# Altium schematic sheet pca10095_sheet3_interface_mcu.SchDoc: PCA10095 - Interface MCU
size A3; Organization: Nordic Semiconductor; DocumentNumber: 3; SheetNumber: 3; SheetTotal: 6; CompanyName: Nordic Semiconductor
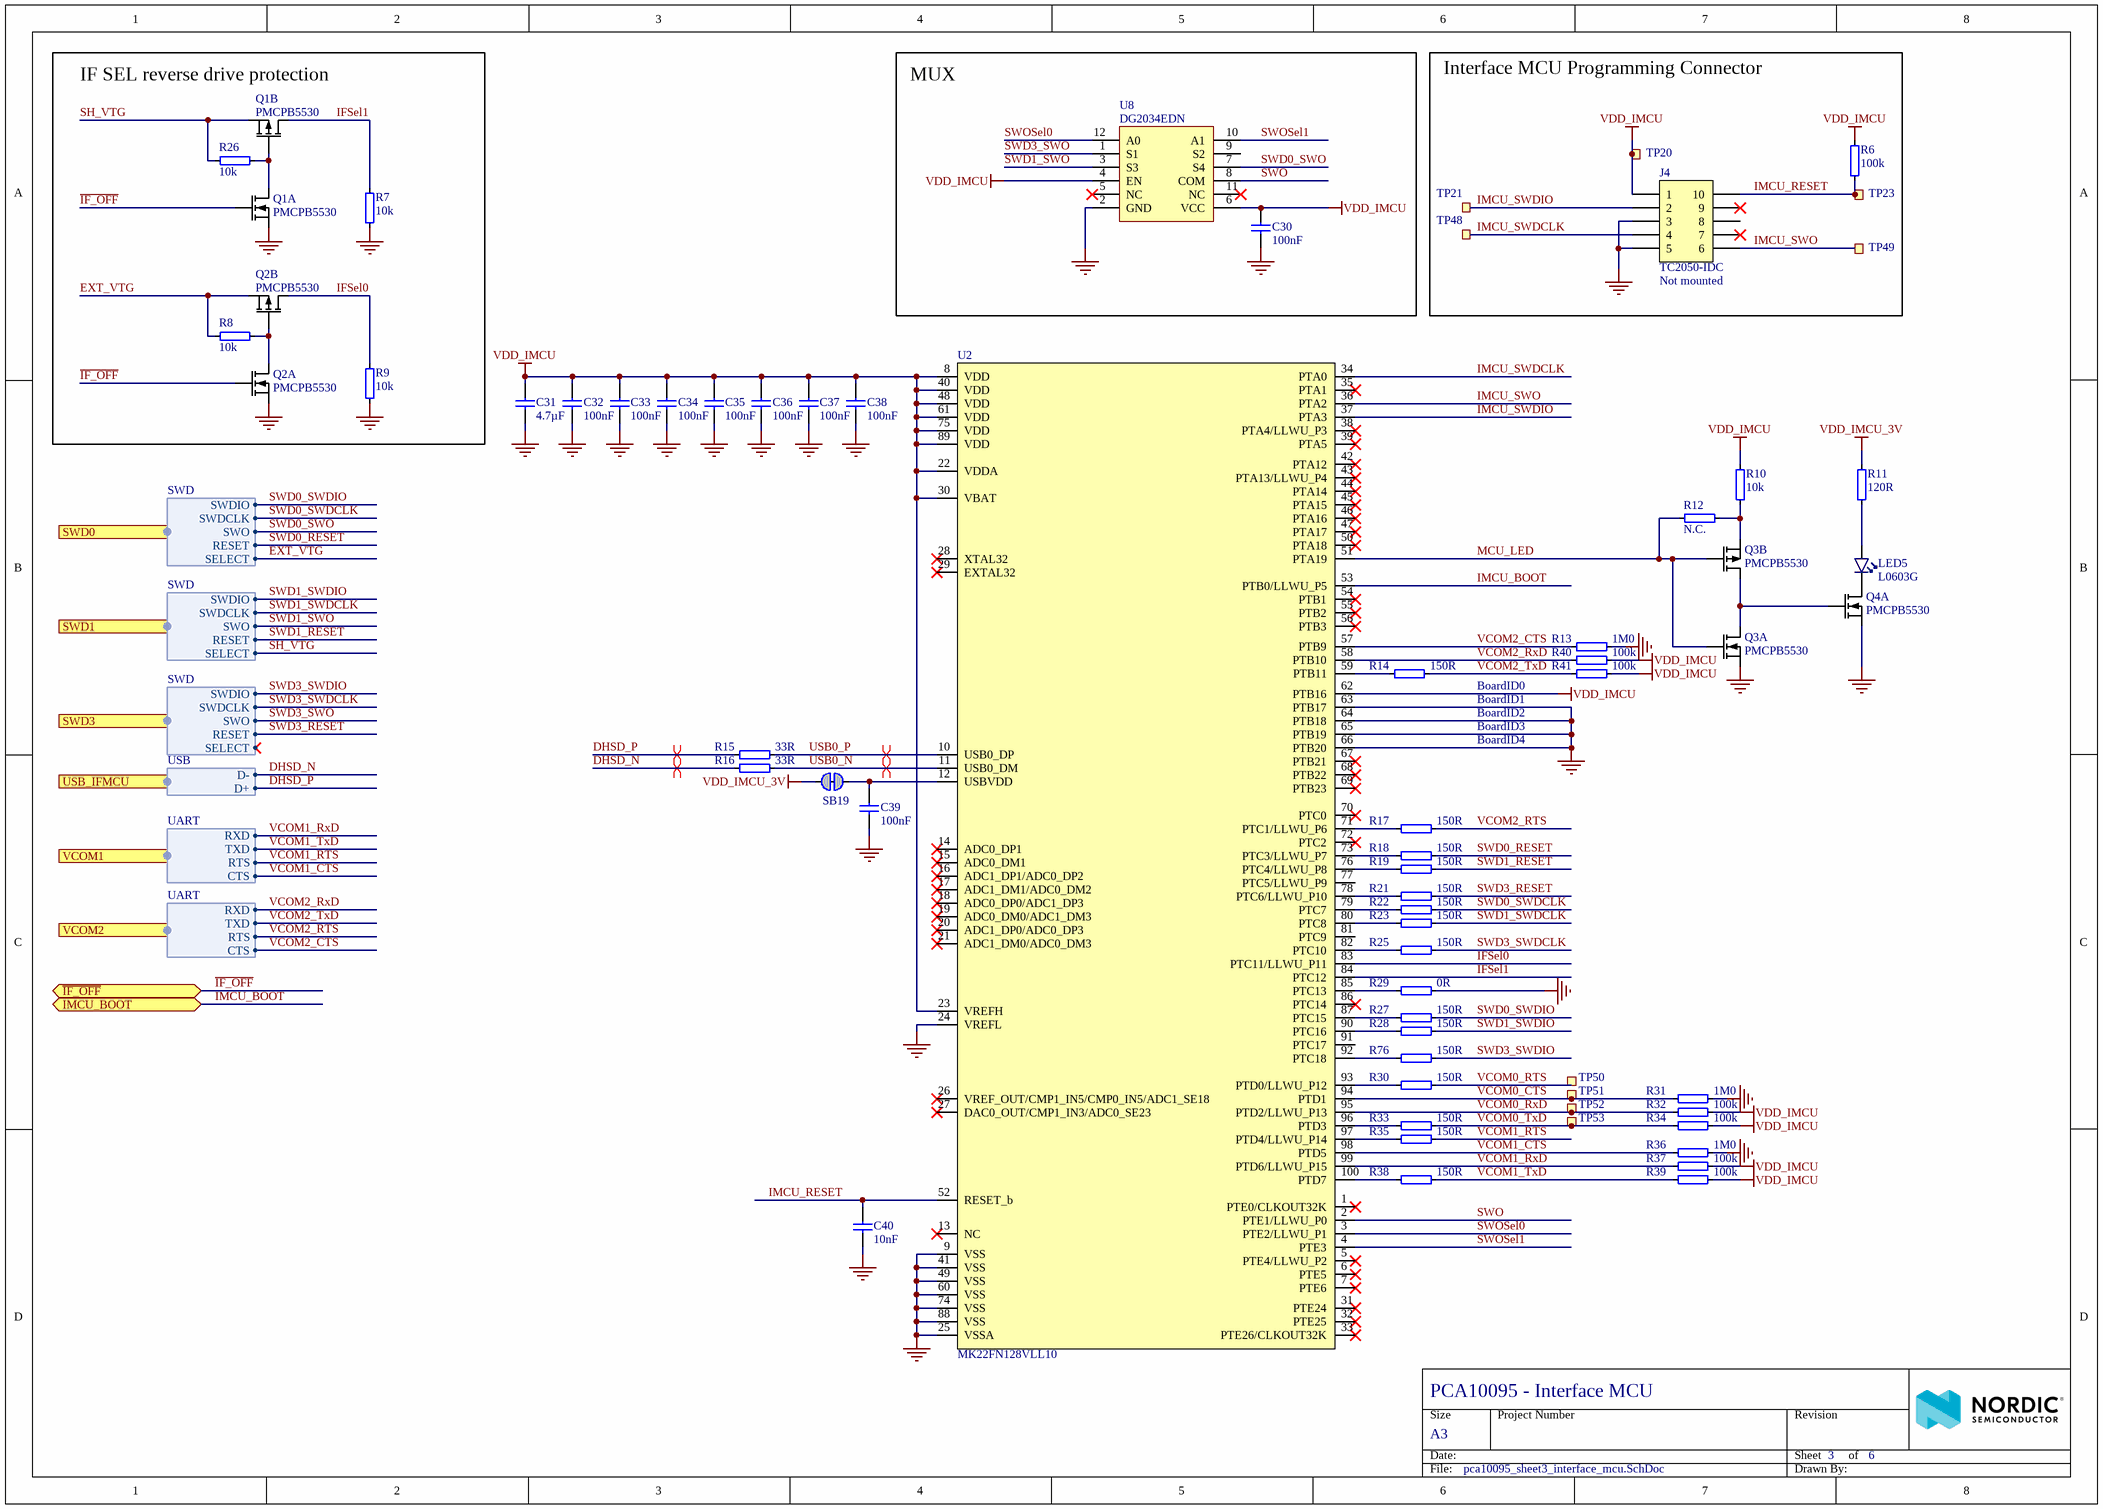
[diagram p0: pca10095_sheet3_interface_mcu.SchDoc]

## Parts
C30  100nF  [CAPC0603X03L_C]
C31  4.7µF  [CAPC1005X04L]
C32  100nF  [CAPC0603X03L_C]
C33  100nF  [CAPC0603X03L_C]
C34  100nF  [CAPC0603X03L_C]
C35  100nF  [CAPC0603X03L_C]
C36  100nF  [CAPC0603X03L_C]
C37  100nF  [CAPC0603X03L_C]
C38  100nF  [CAPC0603X03L_C]
C39  100nF  [CAPC0603X03L_C]
C40  10nF  [CAPC0603X03L_C]
J4  TC2050-IDC  Assembly: Not mounted  [TC2050-IDC-NLFP]  (no BOM)
LED5  L0603G  [LED_0603_G]
Q1  PMCPB5530  [PMCPB5530X]  (parts A,B of 2)
Q2  PMCPB5530  [PMCPB5530X]  (parts A,B of 2)
Q3  PMCPB5530  [PMCPB5530X]  (parts A,B of 2)
Q4  PMCPB5530  [PMCPB5530X]  (part A of 2)
R6  100k  [RESC0603X03L_C]
R7  10k  [RESC0603X03L_C]
R8  10k  [RESC0603X03L_C]
R9  10k  [RESC0603X03L_C]
R10  10k  [RESC0603X03L_C]
R11  120R  [RESC0603X03L_C]
R12  N.C.  [RESC0603X03L_C]
R13  1M0  [RESC0603X03L_C]
R14  150R  [RESC0603X03L_C]
R15  33R  [RESC0603X03L_C]
R16  33R  [RESC0603X03L_C]
R17  150R  [RESC0603X03L_C]
R18  150R  [RESC0603X03L_C]
R19  150R  [RESC0603X03L_C]
R21  150R  [RESC0603X03L_C]
R22  150R  [RESC0603X03L_C]
R23  150R  [RESC0603X03L_C]
R25  150R  [RESC0603X03L_C]
R26  10k  [RESC0603X03L_C]
R27  150R  [RESC0603X03L_C]
R28  150R  [RESC0603X03L_C]
R29  0R  [RESC0603X03L_C]
R30  150R  [RESC0603X03L_C]
R31  1M0  [RESC0603X03L_C]
R32  100k  [RESC0603X03L_C]
R33  150R  [RESC0603X03L_C]
R34  100k  [RESC0603X03L_C]
R35  150R  [RESC0603X03L_C]
R36  1M0  [RESC0603X03L_C]
R37  100k  [RESC0603X03L_C]
R38  150R  [RESC0603X03L_C]
R39  100k  [RESC0603X03L_C]
R40  100k  [RESC0603X03L_C]
R41  100k  [RESC0603X03L_C]
R76  150R  [RESC0603X03L_C]
SB19  Solderbridge  [Solderbridge_Shorted]  (value not drawn)  (net tie, no BOM)
TP20  Ø1.5mm,SMD  [TP_SMD_Ø1.5mm]  (value not drawn)  (no BOM)
TP21  Ø1.5mm,SMD  [TP_SMD_Ø1.5mm]  (value not drawn)  (no BOM)
TP23  Ø1.5mm,SMD  [TP_SMD_Ø1.5mm]  (value not drawn)  (no BOM)
TP48  Ø1.5mm,SMD  [TP_SMD_Ø1.5mm]  (value not drawn)  (no BOM)
TP49  Ø1.5mm,SMD  [TP_SMD_Ø1.5mm]  (value not drawn)  (no BOM)
TP50  Ø1.0mm,SMD  [TP_SMD_Ø1.0mm]  (value not drawn)  (no BOM)
TP51  Ø1.0mm,SMD  [TP_SMD_Ø1.0mm]  (value not drawn)  (no BOM)
TP52  Ø1.0mm,SMD  [TP_SMD_Ø1.0mm]  (value not drawn)  (no BOM)
TP53  Ø1.0mm,SMD  [TP_SMD_Ø1.0mm]  (value not drawn)  (no BOM)
U2  MK22FN128VLL10  [TSQFP50P1600X1600X160-100N]
U8  DG2034EDN  [DG2034EDN]

## Blocks framed on the sheet
IF SEL reverse drive protection: Q1 Q2 R7-R9 R26
MUX: C30 U8
Interface MCU Programming Connector: J4 R6 TP20 TP21 TP23 TP48 TP49

## Ports
IMCU_BOOT (bidir), SWD0 (harness SWD), SWD1 (harness SWD), SWD3 (harness SWD), USB_IFMCU (harness USB), VCOM1 (harness UART), VCOM2 (harness UART), ~{IF_OFF} (bidir)

## Harnesses
SWD: SWDIO, SWDCLK, SWO, RESET, SELECT
USB: D+, D-
UART: RTS, CTS, RXD, TXD

## Nets
GND: C30.2 C31.1 C32.1 C33.1 C34.2 C35.1 C36.1 C37.1 C38.1 C39.2 C40.1 J4.3 J4.5 Q1.1(S1) Q2.1(S1) Q3.1(S1) Q4.1(S1) R7.1 R9.1 R13.2 R29.2 R31.2 R36.2 U2.9(VSS) U2.24(VREFL) U2.25(VSSA) U2.41(VSS) U2.49(VSS) U2.60(VSS) U2.63(PTB17) U2.64(PTB18) U2.65(PTB19) U2.66(PTB20) U2.74(VSS) U2.88(VSS) U8.2(GND)
VDD_IMCU: C30.1 C31.2 C32.2 C33.2 C34.1 C35.2 C36.2 C37.2 C38.2 J4.1 R6.2 R10.2 R32.2 R34.2 R37.2 R39.2 R40.2 R41.2 TP20.1 U2.8(VDD) U2.22(VDDA) U2.23(VREFH) U2.30(VBAT) U2.40(VDD) U2.48(VDD) U2.61(VDD) U2.62(PTB16) U2.75(VDD) U2.89(VDD) U8.4(EN) U8.6(VCC)
VDD_IMCU_3V: R11.2 SB19.2
DHSD_N: R16.1 ; port USB_IFMCU.D-
DHSD_P: R15.1 ; port USB_IFMCU.D+
EXT_VTG: Q2.4(S2) R8.1 ; port SWD0.SELECT
~{IF_OFF}: Q1.2(G1) Q2.2(G1) ; port ~{IF_OFF}
IFSel0: Q2.3(D2) R9.2 U2.83(PTC11/LLWU_P11)
IFSel1: Q1.3(D2) R7.2 U2.84(PTC12)
IMCU_BOOT: U2.53(PTB0/LLWU_P5) ; port IMCU_BOOT
IMCU_RESET: C40.2 J4.10 R6.1 TP23.1 U2.52(RESET_b)
IMCU_SWDCLK: J4.4 TP48.1 U2.34(PTA0)
IMCU_SWDIO: J4.2 TP21.1 U2.37(PTA3)
IMCU_SWO: J4.6 TP49.1 U2.36(PTA2)
MCU_LED: Q3.2(G1) Q3.5(G2) R12.1 U2.51(PTA19)
SH_VTG: Q1.4(S2) R26.1 ; port SWD1.SELECT
SWD0_RESET: R18.2 ; port SWD0.RESET
SWD0_SWDCLK: R22.2 ; port SWD0.SWDCLK
SWD0_SWDIO: R27.2 ; port SWD0.SWDIO
SWD0_SWO: U8.7(S4) ; port SWD0.SWO
SWD1_RESET: R19.2 ; port SWD1.RESET
SWD1_SWDCLK: R23.2 ; port SWD1.SWDCLK
SWD1_SWDIO: R28.2 ; port SWD1.SWDIO
SWD1_SWO: U8.3(S3) ; port SWD1.SWO
SWD3_RESET: R21.2 ; port SWD3.RESET
SWD3_SWDCLK: R25.2 ; port SWD3.SWDCLK
SWD3_SWDIO: R76.2 ; port SWD3.SWDIO
SWD3_SWO: U8.1(S1) ; port SWD3.SWO
SWO: U2.2(PTE1/LLWU_P0) U8.8(COM)
SWOSel0: U2.3(PTE2/LLWU_P1) U8.12(A0)
SWOSel1: U2.4(PTE3) U8.10(A1)
USB0_N: R16.2 U2.11(USB0_DM)
USB0_P: R15.2 U2.10(USB0_DP)
VCOM0_CTS: R31.1 TP51.1 U2.94(PTD1)
VCOM0_RTS: R30.2 TP50.1
VCOM0_RxD: R32.1 TP52.1 U2.95(PTD2/LLWU_P13)
VCOM0_TxD: R33.2 R34.1 TP53.1
VCOM1_CTS: R36.1 U2.98(PTD5) ; port VCOM1.CTS
VCOM1_RTS: R35.2 ; port VCOM1.RTS
VCOM1_RxD: R37.1 U2.99(PTD6/LLWU_P15) ; port VCOM1.RXD
VCOM1_TxD: R38.2 R39.1 ; port VCOM1.TXD
VCOM2_CTS: R13.1 U2.57(PTB9) ; port VCOM2.CTS
VCOM2_RTS: R17.2 ; port VCOM2.RTS
VCOM2_RxD: R40.1 U2.58(PTB10) ; port VCOM2.RXD
VCOM2_TxD: R14.2 R41.1 ; port VCOM2.TXD
NetC39_1: C39.1 SB19.1 U2.12(USBVDD)
NetLED5_1: LED5.1(C) Q4.6(D1)
NetLED5_2: LED5.2(A) R11.1
NetQ1_5: Q1.5(G2) Q1.6(D1) R26.2
NetQ2_5: Q2.5(G2) Q2.6(D1) R8.2
NetQ3_3: Q3.3(D2) Q3.6(D1) Q4.2(G1)
NetQ3_4: Q3.4(S2) R10.1 R12.2
NetR14_1: R14.1 U2.59(PTB11)
NetR17_1: R17.1 U2.71(PTC1/LLWU_P6)
NetR18_1: R18.1 U2.73(PTC3/LLWU_P7)
NetR19_1: R19.1 U2.76(PTC4/LLWU_P8)
NetR21_1: R21.1 U2.78(PTC6/LLWU_P10)
NetR22_1: R22.1 U2.79(PTC7)
NetR23_1: R23.1 U2.80(PTC8)
NetR25_1: R25.1 U2.82(PTC10)
NetR27_1: R27.1 U2.87(PTC15)
NetR28_1: R28.1 U2.90(PTC16)
NetR29_1: R29.1 U2.85(PTC13)
NetR30_1: R30.1 U2.93(PTD0/LLWU_P12)
NetR33_1: R33.1 U2.96(PTD3)
NetR35_1: R35.1 U2.97(PTD4/LLWU_P14)
NetR38_1: R38.1 U2.100(PTD7)
NetR76_1: R76.1 U2.92(PTC18)

Not connected (* = marked no-connect by the designer): J4 7* 8 9*; U2 1(PTE0/CLKOUT32K)* 5(PTE4/LLWU_P2)* 6(PTE5)* 7(PTE6)* 13(NC)* 14(ADC0_DP1)* 15(ADC0_DM1)* 16(ADC1_DP1/ADC0_DP2)* 17(ADC1_DM1/ADC0_DM2)* 18(ADC0_DP0/ADC1_DP3)* 19(ADC0_DM0/ADC1_DM3)* 20(ADC1_DP0/ADC0_DP3)* 21(ADC1_DM0/ADC0_DM3)* 26(VREF_OUT/CMP1_IN5/CMP0_IN5/ADC1_SE18)* 27(DAC0_OUT/CMP1_IN3/ADC0_SE23)* 28(XTAL32)* 29(EXTAL32)* 31(PTE24)* 32(PTE25)* 33(PTE26/CLKOUT32K)* 35(PTA1)* 38(PTA4/LLWU_P3)* 39(PTA5)* 42(PTA12)* 43(PTA13/LLWU_P4)* 44(PTA14)* 45(PTA15)* 46(PTA16)* 47(PTA17)* 50(PTA18)* 54(PTB1)* 55(PTB2)* 56(PTB3)* 67(PTB21)* 68(PTB22)* 69(PTB23)* 70(PTC0)* 72(PTC2)* 77(PTC5/LLWU_P9) 81(PTC9) 86(PTC14)* 91(PTC17); U8 5(NC)* 9(S2) 11(NC)*

## Layout directives
differential pair: DHSD_N, DHSD_P, USB0_N, USB0_P

## Notes on the sheet
- BoardID0
- BoardID1
- BoardID2
- BoardID3
- BoardID4
- Size
- Date:
- A3
- Project Number
- Sheet         of
- Revision
- File:
- Drawn By:

## Library data of the parts
C30 C32-C39 = C0201-100n: Capacitor, X5R, ±10%; Part number IPS: 00000001248; Note: 16V; Artikkelnr Noca: N.A.; Part Number: C0201-100n; Manufacturer: *; Manufacturer Part Number: *; ComponentLink1URL: *; ComponentLink1Description: Datasheet; ComponentLink2URL: *; ComponentLink2Description: Supplier link; HelpURL: *; Footprint Doc: 0201; LatestRevisionDate: 2017-11-09; Pin Count: 2; Publisher: Nordic Semiconductor; Published: 2014-11-13; Value: 100nF; Supplier 1: *; Supplier Part Number 1: *; Supplier 2: *; Supplier Part Number 2: *
C31 = C0402-4µ7-10V-X5R: CAP CER 4.7UF 10V X5R 0402; Manufacturer: Murata; Manufacturer Part Number: GRM155R61A475MEAAD; Artikkelnr Noca: N.A.; Part Number: C0402-4µ7-10V-X5R; ComponentLink1URL: http://search.murata.co.jp/Ceramy/image/img/A01X/G101/ENG/GRM155R61A475MEAA-01.pdf; ComponentLink1Description: Datasheet; ComponentLink2URL: https://www.digikey.com/product-detail/en/murata-electronics-north-america/GRM155R61A475MEAAD/490-14306-1-ND/6234742; ComponentLink2Description: Supplier link - Digikey; HelpURL: https://psearch.en.murata.com/capacitor/product/GRM155R61A475MEAA%23.html; Footprint Doc: 0402; LatestRevisionDate: 2018-10-04; Pin Count: 2; Publisher: Nordic Semiconductor; Published: 2018-10-04; Value: 4.7µF; Note: 10V; Supplier 1: Digi-Key; Supplier Part Number 1: 490-14306-1-ND; Supplier 2: *; Supplier Part Number 2: *; Part number IPS: N.A.
C40 = C0201-10n: Capacitor, X7R, ±10%; Part number IPS: 00000003480; Note: 10V; Artikkelnr Noca: N.A.; Part Number: C0201-10n; Manufacturer: *; Manufacturer Part Number: *; ComponentLink1URL: *; ComponentLink1Description: Datasheet; ComponentLink2URL: *; ComponentLink2Description: Supplier link; HelpURL: *; Footprint Doc: 0201; LatestRevisionDate: 2017-11-09; Pin Count: 2; Publisher: Nordic Semiconductor; Published: 2014-11-13; Value: 10nF; Supplier 1: *; Supplier Part Number 1: *; Supplier 2: *; Supplier Part Number 2: *
J4 = TC2050-IDC-NLFP: CBL PLUG-OF-NAILS 10-PIN; Manufacturer: Tag-Connect LLC; Artikkelnr Noca: N.A.; Part Number: TC2050-IDC-NLFP; Manufacturer Part Number: TC2050-IDC-NLFP; LatestRevisionDate: 2012-11-21; Publisher: Nordic Semiconductor; Published: 2012-11-21; Value: TC2050-IDC; Pin Count: 10; Footprint Doc: TC2050-IDC-NLFP; Part number IPS: N.A.; ComponentLink1URL: *; ComponentLink1Description: Datasheet; ComponentLink2URL: *; ComponentLink2Description: Supplier link; HelpURL: http://www.tag-connect.com/Materials/TC2050-IDC%20Datasheet.pdf; Supplier 1: Digi-Key; Supplier Part Number 1: TC2050-IDC-NL-ND; Supplier 2: *; Supplier Part Number 2: *
LED5 = LG L29K Smartled Green: LED, Green, 0603, 570nm, Vf=1.7V, 2.24..5.6mcd, - 40 to +100°C; Manufacturer: Osram; Manufacturer Part Number: LG L29K-G2J1-24-Z; Part number IPS: N.A.; Note: 2.24..5.6 mcd, Vfmin=1.7V; Artikkelnr Noca: 13019147; Part Number: LG L29K Smartled Green; Footprint Doc: 0603; LatestRevisionDate: 2017-08-21; Pin Count: 2; Publisher: Nordic Semiconductor; Published: 2014-10-28; Value: L0603G; ComponentLink1URL: *; ComponentLink1Description: Datasheet; ComponentLink2URL: *; ComponentLink2Description: Supplier link; HelpURL: http://www.osram-os.com/Graphics/XPic2/00077107_0.pdf; Supplier 1: Digi-Key; Supplier Part Number 1: 475-2709-1-ND; Supplier 2: Mouser; Supplier Part Number 2: 720-LGL29KG2J124Z
Q1-Q4 = PMCPB5530X,115: Mosfet Array N and P-Channel 20V 4A (Ta), 3.4A (Ta) 490mW Surface Mount 6-HUSON-EP (2x2); Manufacturer: Nexperia; Artikkelnr Noca: N.A.; Part Number: PMCPB5530X,115; Manufacturer Part Number: PMCPB5530X,115; ComponentLink1URL: https://assets.nexperia.com/documents/data-sheet/PMCPB5530X.pdf; ComponentLink1Description: Datasheet; ComponentLink2URL: https://www.digikey.com/product-detail/en/nexperia-usa-inc/PMCPB5530X115/1727-1327-1-ND/4386339; ComponentLink2Description: Supplier link; HelpURL: https://www.nexperia.com/products/mosfets/small-signal-mosfets/PMCPB5530X.html; Footprint Doc: 6-UDFN; LatestRevisionDate: 2018-04-30; Pin Count: 8; Publisher: Nordic Semiconductor; Published: 2018-04-30; Value: PMCPB5530; Note: *; Supplier 1: Digi-Key; Supplier Part Number 1: 1727-1327-1-ND; Supplier 2: Mouser; Supplier Part Number 2: 771-PMCPB5530X115; Part number IPS: N.A.
R6 R32 R34 R37 R39-R41 = R0201-100k: Resistor, ±1%, 0.05W; Part number IPS: 00000001419; Note: Chip Res 1%; Artikkelnr Noca: N.A.; Part Number: R0201-100k; Manufacturer: *; Manufacturer Part Number: *; ComponentLink1URL: *; ComponentLink1Description: Datasheet; ComponentLink2URL: *; ComponentLink2Description: Supplier link; HelpURL: *; Footprint Doc: 0201; LatestRevisionDate: 2014-11-13; Pin Count: 2; Publisher: Nordic Semiconductor; Published: 2014-11-13; Value: 100k; Supplier 1: *; Supplier Part Number 1: *; Supplier 2: *; Supplier Part Number 2: *
R7-R10 R26 = R0201-10k: Resistor, ±1%, 0.05W; Part number IPS: 00000001255; Note: Chip Res 1%; Artikkelnr Noca: N.A.; Part Number: R0201-10k; Manufacturer: *; Manufacturer Part Number: *; Footprint Doc: 0201; LatestRevisionDate: 2014-11-13; Pin Count: 2; Publisher: Nordic Semiconductor; Published: 2014-11-13; Value: 10k; ComponentLink1URL: *; ComponentLink1Description: Datasheet; ComponentLink2URL: *; ComponentLink2Description: Supplier link; HelpURL: *; Supplier 1: *; Supplier Part Number 1: *; Supplier 2: *; Supplier Part Number 2: *
R11 = R0201-120: Resistor, ±1%, 0.05W; Note: Chip Res 1%; Artikkelnr Noca: N.A.; Part Number: R0201-120; Manufacturer: *; Manufacturer Part Number: *; ComponentLink1URL: *; ComponentLink1Description: Datasheet; ComponentLink2URL: *; ComponentLink2Description: Supplier link; HelpURL: *; Footprint Doc: 0201; LatestRevisionDate: 2014-11-13; Pin Count: 2; Publisher: Nordic Semiconductor; Published: 2014-11-13; Value: 120R; Supplier 1: *; Supplier Part Number 1: *; Supplier 2: *; Supplier Part Number 2: *; Part number IPS: N.A.
R12 = R0201-N.C.: Not mounted; Note: Chip Res; Artikkelnr Noca: N.A.; Assembly: Not mounted; Part Number: R0201-N.C.; Manufacturer: *; Manufacturer Part Number: *; ComponentLink1URL: *; ComponentLink1Description: Datasheet; ComponentLink2URL: *; ComponentLink2Description: Supplier link; HelpURL: *; Footprint Doc: 0201; LatestRevisionDate: 2014-11-13; Pin Count: 2; Publisher: Nordic Semiconductor; Published: 2014-11-13; Value: N.C.; Supplier 1: *; Supplier Part Number 1: *; Supplier 2: *; Supplier Part Number 2: *; Part number IPS: N.A.
R13 R31 R36 = R0201-1M0: Resistor, ±1%, 0.05W; Note: Chip Res 1%; Artikkelnr Noca: N.A.; Part Number: R0201-1M0; Manufacturer: *; Manufacturer Part Number: *; ComponentLink1URL: *; ComponentLink1Description: Datasheet; ComponentLink2URL: *; ComponentLink2Description: Supplier link; HelpURL: *; Footprint Doc: 0201; LatestRevisionDate: 2014-11-13; Pin Count: 2; Publisher: Nordic Semiconductor; Published: 2014-11-13; Value: 1M0; Supplier 1: *; Supplier Part Number 1: *; Supplier 2: *; Supplier Part Number 2: *; Part number IPS: N.A.
R14 R17-R19 R21-R23 R25 R27 R28 R30 R33 R35 R38 R76 = R0201-150: Resistor, ±1%, 0.05W; Note: Chip Res 1%; Artikkelnr Noca: N.A.; Part Number: R0201-150; Manufacturer: *; Manufacturer Part Number: *; ComponentLink1URL: *; ComponentLink1Description: Datasheet; ComponentLink2URL: *; ComponentLink2Description: Supplier link; HelpURL: *; Footprint Doc: 0201; LatestRevisionDate: 2014-11-13; Pin Count: 2; Publisher: Nordic Semiconductor; Published: 2014-11-13; Value: 150R; Part number IPS: N.A.; Supplier 1: *; Supplier Part Number 1: *; Supplier 2: *; Supplier Part Number 2: *
R15 R16 = R0201-33R: Resistor, ±1%, 0.05W; Note: Chip Res 1%; Artikkelnr Noca: N.A.; Part Number: R0201-33R; Manufacturer: *; Manufacturer Part Number: *; ComponentLink1URL: *; ComponentLink1Description: Datasheet; ComponentLink2URL: *; ComponentLink2Description: Supplier link; HelpURL: *; Footprint Doc: 0201; LatestRevisionDate: 2014-11-13; Pin Count: 2; Publisher: Nordic Semiconductor; Published: 2014-11-13; Value: 33R; Part number IPS: N.A.; Supplier 1: *; Supplier Part Number 1: *; Supplier 2: *; Supplier Part Number 2: *
R29 = R0201-0R: Resistor, ±5%, 0.05W; Part number IPS: 00000003245; Note: Chip Res 5%; Artikkelnr Noca: N.A.; Part Number: R0201-0R; Manufacturer: *; Manufacturer Part Number: *; ComponentLink1URL: *; ComponentLink1Description: Datasheet; ComponentLink2URL: *; ComponentLink2Description: Supplier link; HelpURL: *; Footprint Doc: 0201; LatestRevisionDate: 2017-11-09; Pin Count: 2; Publisher: Nordic Semiconductor; Published: 2014-11-13; Value: 0R; Supplier 1: *; Supplier Part Number 1: *; Supplier 2: *; Supplier Part Number 2: *
SB19 = Solderbridge Shorted: Shorted Solderbridge; Artikkelnr Noca: N.A.; Part Number: Solderbridge Shorted; Manufacturer: *; Manufacturer Part Number: *; ComponentLink1URL: *; ComponentLink1Description: Datasheet; ComponentLink2URL: *; ComponentLink2Description: Supplier link; HelpURL: *; Footprint Doc: Solderbridge_Shorted; LatestRevisionDate: 2012-08-07; Pin Count: 2; Publisher: Nordic Semiconductor; Published: 2012-08-07; Value: Solderbridge; Note: *; Supplier 1: *; Supplier Part Number 1: *; Supplier 2: *; Supplier Part Number 2: *; Part number IPS: N.A.
TP20 TP21 TP23 TP48 TP49 = TP_SMD_Ø1.5MM: 1.0mm circular SMD testpad; Manufacturer: Nordic Semiconductor; Artikkelnr Noca: N.A.; Part Number: TP_SMD_Ø1.5MM; Manufacturer Part Number: *; ComponentLink1URL: *; ComponentLink1Description: Datasheet; ComponentLink2URL: *; ComponentLink2Description: Supplier link; HelpURL: *; Footprint Doc: TP_SMD_Ø1.5mm; LatestRevisionDate: 2016-06-02; Pin Count: 1; Publisher: Nordic Semiconductor; Published: 2016-06-02; Value: Ø1.5mm,SMD; Note: *; Part number IPS: N.A.; Supplier 1: *; Supplier Part Number 1: *; Supplier 2: *; Supplier Part Number 2: *
TP50-TP53 = TP_SMD_Ø1.0MM: 1.0mm circular SMD testpad; Manufacturer: Nordic Semiconductor; Artikkelnr Noca: N.A.; Part Number: TP_SMD_Ø1.0MM; Manufacturer Part Number: *; LatestRevisionDate: 2013-06-11; Pin Count: 1; Publisher: Nordic Semiconductor; Published: 2013-06-11; Value: Ø1.0mm,SMD; Note: *; Footprint Doc: TP_SMD_Ø1.0mm; Part number IPS: N.A.; ComponentLink1URL: *; ComponentLink1Description: Datasheet; ComponentLink2URL: *; ComponentLink2Description: Supplier link; HelpURL: *; Supplier 1: *; Supplier Part Number 1: *; Supplier 2: *; Supplier Part Number 2: *
U2 = MK22FN128VLL10: 100MHz Cortex-M4F Performance MCU, 128kB Flash, 24kB SRAM, Full-Speed USB; Manufacturer: NXP; Part number IPS: 00000001366; Artikkelnr Noca: N.A.; Part Number: MK22FN128VLL10; Manufacturer Part Number: MK22FN128VLL10; ComponentLink1URL: http://cache.freescale.com/files/microcontrollers/doc/data_sheet/K22P121M100SF9.pdf; ComponentLink1Description: Datasheet; ComponentLink2URL: https://cache.nxp.com/docs/en/package-information/98ASS23308W.pdf; ComponentLink2Description: Supplier link; HelpURL: *; Footprint Doc: LQFP-100; LatestRevisionDate: 2019-03-01; Pin Count: 100; Publisher: Nordic Semiconductor; Published: 2018-05-10; Value: MK22FN128VLL10; Note: *; Supplier 1: Digi-Key; Supplier Part Number 1: MK22FN128VLL10-ND; Supplier 2: Mouser; Supplier Part Number 2: 841-MK22FN128VLL10
U8 = DG2034EDN: POWER DOWN FAULT PROTECTED,1.8VT; Manufacturer: Vishay Siliconix; Manufacturer Part Number: DG2034EDN-T1-GE4; Artikkelnr Noca: N.A.; Part Number: DG2034EDN; ComponentLink1URL: http://www.vishay.com/docs/73172/dg2034e.pdf; ComponentLink1Description: Datasheet; ComponentLink2Description: Supplier link; Footprint Doc: 12-QFN; LatestRevisionDate: 2018-05-30; Pin Count: 12; Publisher: Nordic Semiconductor; Published: 2018-05-30; Value: DG2034EDN; Note: *; Part number IPS: N.A.; Supplier 1: Digi-Key; Supplier Part Number 1: DG2034EDN-T1-GE4CT-ND; Supplier 2: Mouser; Supplier Part Number 2: 78-DG2034EDN-T1-GE4